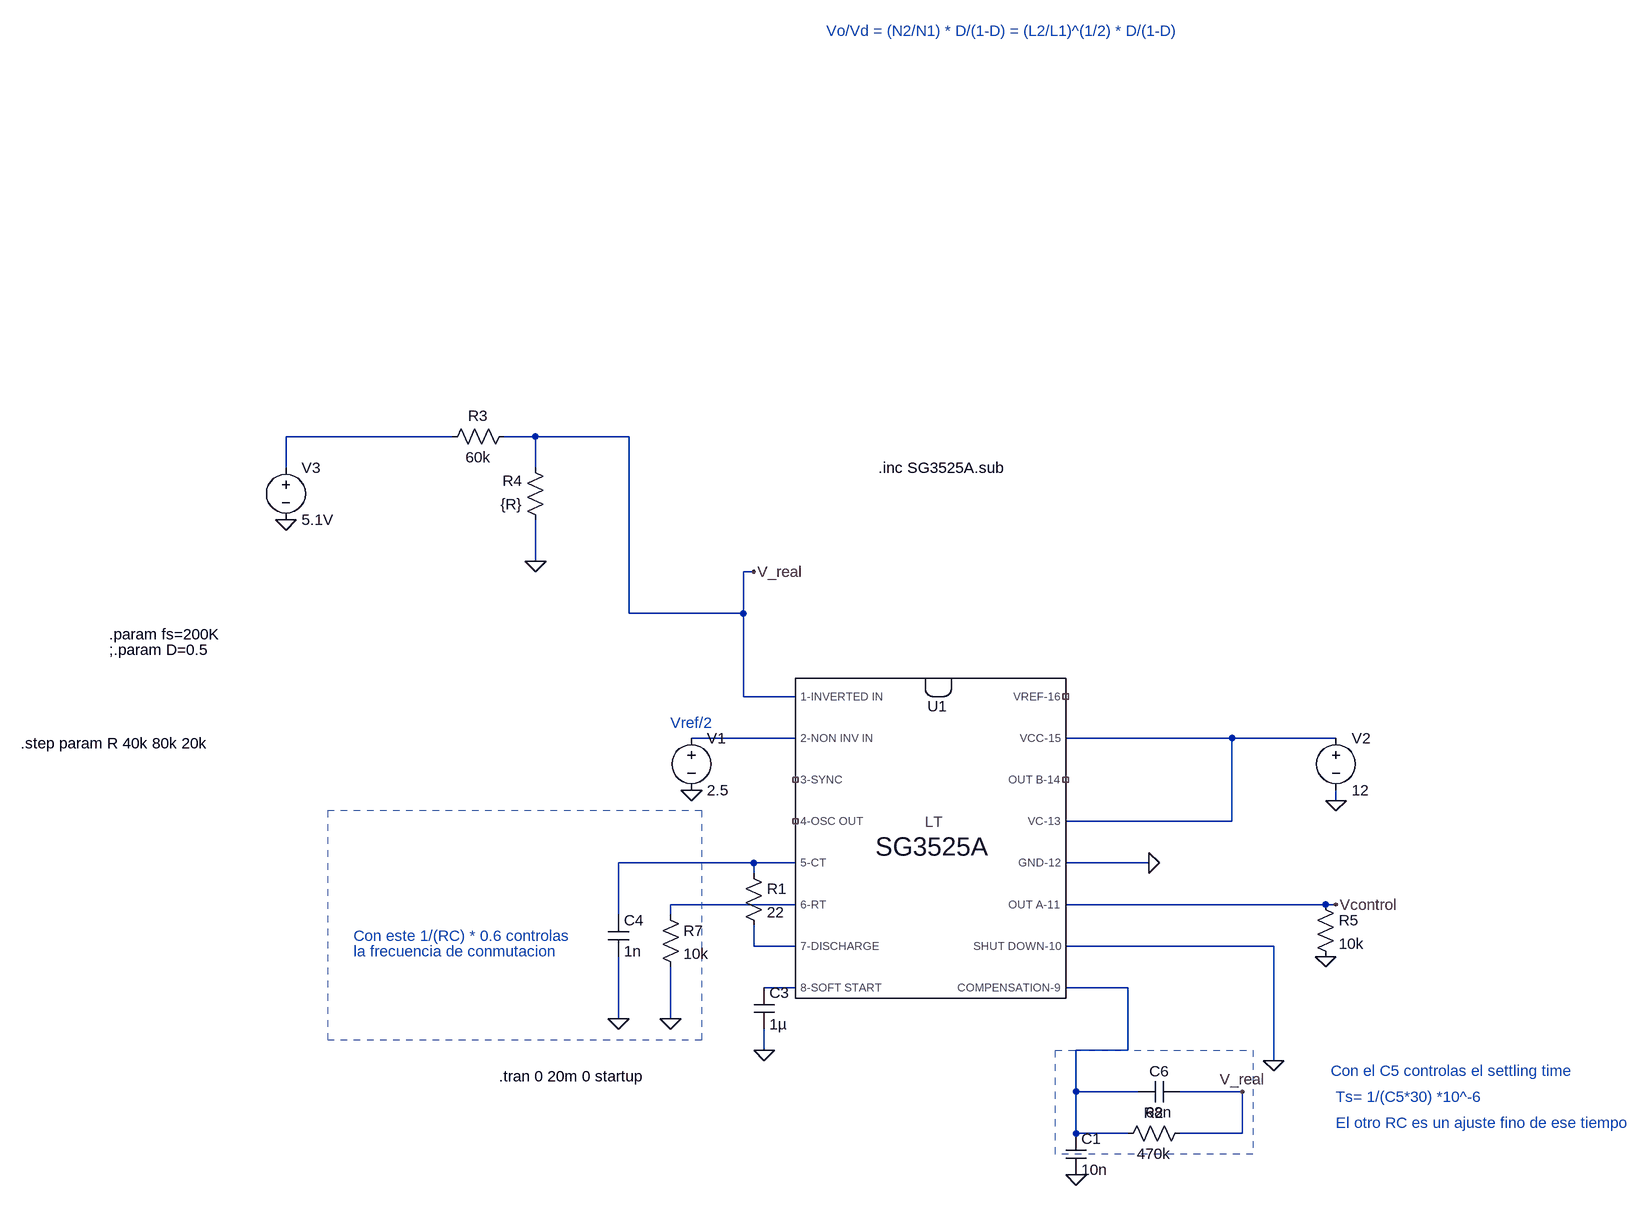
[diagram p0: schematic SGTEST.asc]
SGTEST.asc, the LTspice schematic file:
Version 4
SHEET 1 2728 2080
WIRE -704 -496 -960 -496
WIRE -576 -496 -624 -496
WIRE -432 -496 -576 -496
WIRE -960 -448 -960 -496
WIRE -576 -448 -576 -496
WIRE -576 -304 -576 -368
WIRE -240 -288 -256 -288
WIRE -432 -224 -432 -496
WIRE -256 -224 -256 -288
WIRE -256 -224 -432 -224
WIRE -256 -96 -256 -224
WIRE -176 -96 -256 -96
WIRE -176 -32 -336 -32
WIRE 496 -32 240 -32
WIRE 656 -32 496 -32
WIRE 656 64 656 48
WIRE 496 96 496 -32
WIRE 496 96 240 96
WIRE -240 160 -448 160
WIRE -176 160 -240 160
WIRE 368 160 240 160
WIRE -240 176 -240 160
WIRE -176 224 -368 224
WIRE 640 224 240 224
WIRE 656 224 640 224
WIRE -448 240 -448 160
WIRE -368 240 -368 224
WIRE -240 288 -240 256
WIRE -176 288 -240 288
WIRE 560 288 240 288
WIRE -176 352 -224 352
WIRE 336 352 240 352
WIRE -448 400 -448 304
WIRE -368 400 -368 320
WIRE -224 448 -224 416
WIRE 336 448 336 352
WIRE 336 448 256 448
WIRE 560 464 560 288
WIRE 256 512 256 448
WIRE 352 512 256 512
WIRE 512 512 416 512
WIRE 256 576 256 512
WIRE 336 576 256 576
WIRE 512 576 512 512
WIRE 512 576 416 576
FLAG 368 160 0
FLAG 656 224 Vcontrol
FLAG 560 464 0
FLAG -224 448 0
FLAG -368 400 0
FLAG -448 400 0
FLAG 656 64 0
FLAG 512 512 V_real
FLAG 256 640 0
FLAG 640 304 0
FLAG -336 48 0
FLAG -240 -288 V_real
FLAG -960 -368 0
FLAG -576 -304 0
SYMBOL cap -240 352 R0
SYMATTR InstName C3
SYMATTR Value 1µ
SYMBOL res -384 224 R0
SYMATTR InstName R7
SYMATTR Value 10k
SYMBOL cap -464 240 R0
SYMATTR InstName C4
SYMATTR Value 1n
SYMBOL SG3525A -32 0 R0
SYMATTR InstName U1
SYMATTR Value SG3525A
SYMBOL cap 416 496 R90
WINDOW 0 0 32 VBottom 2
WINDOW 3 32 32 VTop 2
SYMATTR InstName C6
SYMATTR Value 68n
SYMBOL voltage 656 -48 R0
WINDOW 123 0 0 Left 0
WINDOW 39 0 0 Left 0
SYMATTR InstName V2
SYMATTR Value 12
SYMBOL voltage -336 -48 R0
WINDOW 123 0 0 Left 0
WINDOW 39 0 0 Left 0
SYMATTR InstName V1
SYMATTR Value 2.5
SYMBOL res -256 160 R0
SYMATTR InstName R1
SYMATTR Value 22
SYMBOL cap 240 576 R0
SYMATTR InstName C1
SYMATTR Value 10n
SYMBOL res 432 560 R90
WINDOW 0 0 56 VBottom 2
WINDOW 3 32 56 VTop 2
SYMATTR InstName R2
SYMATTR Value 470k
SYMBOL res 624 208 R0
SYMATTR InstName R5
SYMATTR Value 10k
SYMBOL voltage -960 -464 R0
WINDOW 123 0 0 Left 0
WINDOW 39 0 0 Left 0
SYMATTR InstName V3
SYMATTR Value 5.1V
SYMBOL res -608 -512 R90
WINDOW 0 0 56 VBottom 2
WINDOW 3 32 56 VTop 2
SYMATTR InstName R3
SYMATTR Value 60k
SYMBOL res -560 -352 R180
WINDOW 0 36 76 Left 2
WINDOW 3 36 40 Left 2
SYMATTR InstName R4
SYMATTR Value {R}
TEXT -128 -1120 Left 2 ;Vo/Vd = (N2/N1) * D/(1-D) = (L2/L1)^(1/2) * D/(1-D)
TEXT -1232 -192 Left 2 !.param fs=200K
TEXT -1232 -168 Left 2 !;.param D=0.5
TEXT -1368 -24 Left 2 !.step param R 40k 80k 20k
TEXT -368 -56 Left 2 ;Vref/2
TEXT -632 488 Left 2 !.tran 0 20m 0 startup
TEXT -48 -448 Left 2 !.inc SG3525A.sub
TEXT -856 272 Left 2 ;Con este 1/(RC) * 0.6 controlas
TEXT -856 296 Left 2 ;la frecuencia de conmutacion
TEXT 648 480 Left 2 ;Con el C5 controlas el settling time
TEXT 656 520 Left 2 ;Ts= 1/(C5*30) *10^-6
TEXT 656 560 Left 2 ;El otro RC es un ajuste fino de ese tiempo
LINE Normal -320 432 -320 80 2
LINE Normal -896 432 -320 432 2
LINE Normal -896 80 -896 432 2
LINE Normal -320 80 -896 80 2
LINE Normal 224 544 224 448 2
LINE Normal 224 608 224 544 2
LINE Normal 528 608 224 608 2
LINE Normal 528 448 528 608 2
LINE Normal 224 448 528 448 2

The netlist it stands for:
* SGTEST.asc
C3 N007 0 1µ
R7 N005 0 10k
C4 N004 0 1n
XU1 V_real N002 NC_01 NC_02 N004 N005 N006 N007 N008 0 Vcontrol 0 N003 NC_03 N003 NC_04 SG3525A  ; pins 1-INVERTED_IN 2-NON_INV_IN 3-SYNC 4-OSC_OUT 5-CT 6-RT 7-DISCHARGE 8-SOFT_START COMPENSATION-9 SHUT_DOWN-10 OUT_A-11 GND-12 VC-13 OUT_B-14 VCC-15 VREF-16
C6 V_real N008 68n
V2 N003 0 12
V1 N002 0 2.5
R1 N004 N006 22
C1 N008 0 10n
R2 V_real N008 470k
R5 Vcontrol 0 10k
V3 N001 0 5.1V
R3 V_real N001 60k
R4 0 V_real {R}
* Vo/Vd = (N2/N1) * D/(1-D) = (L2/L1)^(1/2) * D/(1-D)
.param fs=200K
;.param D=0.5
.step param R 40k 80k 20k
* Vref/2
.tran 0 20m 0 startup
.inc SG3525A.sub
* Con este 1/(RC) * 0.6 controlas
* la frecuencia de conmutacion
* Con el C5 controlas el settling time
* Ts= 1/(C5*30) *10^-6
* El otro RC es un ajuste fino de ese tiempo
.backanno
.end